# Altium schematic sheet VCO.SchDoc
size A4
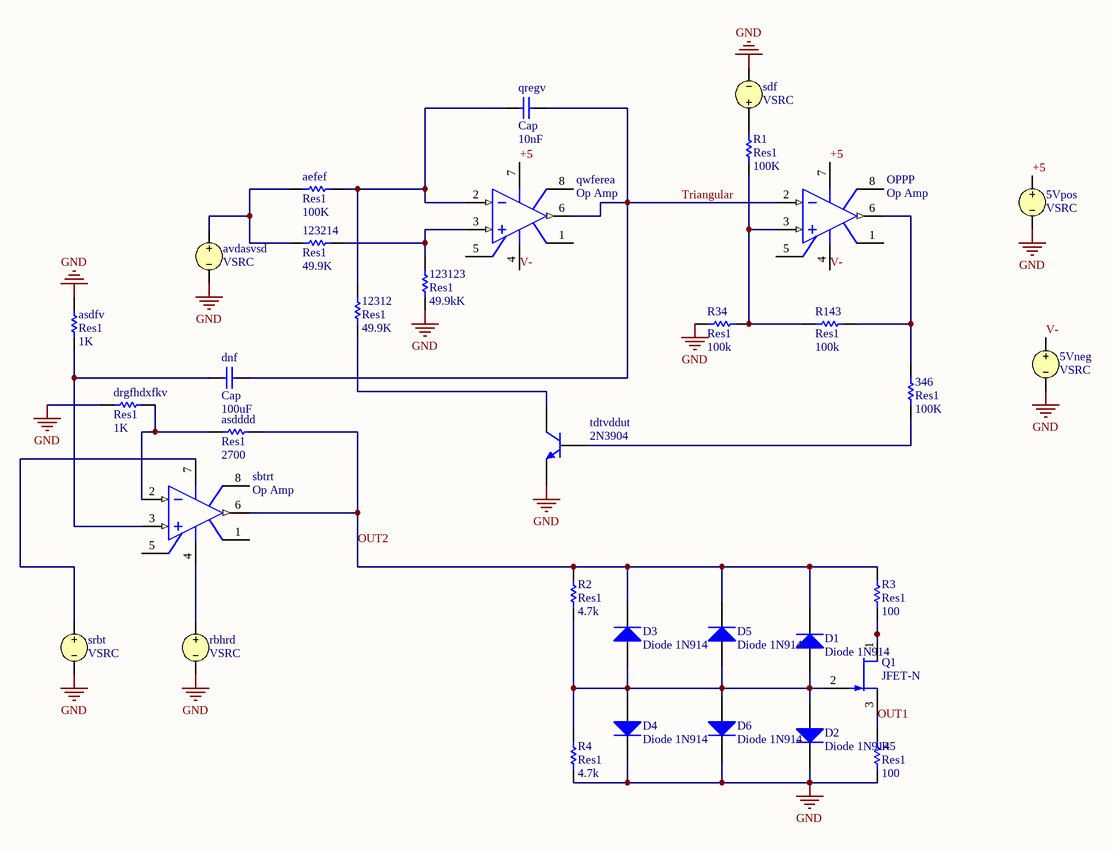
[diagram p0: VCO.SchDoc]

## Parts
5Vneg  VSRC
5Vpos  VSRC
346  Res1  value 100K  [AXIAL-0.3]
12312  Res1  value 49.9K  [AXIAL-0.3]
123123  Res1  value 49.9kK  [AXIAL-0.3]
123214  Res1  value 49.9K  [AXIAL-0.3]
aefef  Res1  value 100K  [AXIAL-0.3]
asdddd  Res1  value 2700  [AXIAL-0.3]
asdfv  Res1  value 1K  [AXIAL-0.3]
avdasvsd  VSRC
D1  Diode 1N914  [DO-35]
D2  Diode 1N914  [DO-35]
D3  Diode 1N914  [DO-35]
D4  Diode 1N914  [DO-35]
D5  Diode 1N914  [DO-35]
D6  Diode 1N914  [DO-35]
dnf  Cap  value 100uF  [RAD-0.3]
drgfhdxfkv  Res1  value 1K  [AXIAL-0.3]
OPPP  Op Amp  [H-08A]
Q1  JFET-N  [TO-254-AA]
qregv  Cap  value 10nF  [RAD-0.3]
qwferea  Op Amp  [H-08A]
R1  Res1  value 100K  [AXIAL-0.3]
R2  Res1  value 4.7k  [AXIAL-0.3]
R3  Res1  value 100  [AXIAL-0.3]
R4  Res1  value 4.7k  [AXIAL-0.3]
R5  Res1  value 100  [AXIAL-0.3]
R34  Res1  value 100k  [AXIAL-0.3]
R143  Res1  value 100k  [AXIAL-0.3]
rbhrd  VSRC
sbtrt  Op Amp  [H-08A]
sdf  VSRC
srbt  VSRC
tdtvddut  2N3904  [TO-92A]

## Nets
GND: 5Vneg.2 5Vpos.2 123123.1 asdfv.2 avdasvsd.2 D2.2(K) D4.2(K) D6.2(K) drgfhdxfkv.2 R4.1 R5.1 R34.1 rbhrd.2 sdf.2 srbt.2 tdtvddut.1(E)
+5: 5Vpos.1 OPPP.7(V+) qwferea.7(V+)
OUT1: Q1.3(S) R5.2
OUT2: asdddd.2 D1.2(K) D3.2(K) D5.2(K) R2.2 R3.2 sbtrt.6(OUT)
Triangular: dnf.2 OPPP.2(IN-) qregv.2 qwferea.6(OUT)
V-: 5Vneg.1 OPPP.4(V-) qwferea.4(V-)
Net346_1: 346.1 tdtvddut.2(B)
Net346_2: 346.2 OPPP.6(OUT) R143.2
Net12312_1: 12312.1 tdtvddut.3(C)
Net12312_2: 12312.2 aefef.2 qregv.1 qwferea.2(IN-)
Net123123_2: 123123.2 123214.2 qwferea.3(IN+)
Net123214_1: 123214.1 aefef.1 avdasvsd.1
Netasdddd_1: asdddd.1 drgfhdxfkv.1 sbtrt.2(IN-)
Netasdfv_1: asdfv.1 dnf.1 sbtrt.3(IN+)
NetD1_1: D1.1(A) D2.1(A) D3.1(A) D4.1(A) D5.1(A) D6.1(A) Q1.2(G) R2.1 R4.2
NetOPPP_3: OPPP.3(IN+) R1.1 R34.2 R143.1
NetQ1_1: Q1.1(D) R3.1
NetR1_2: R1.2 sdf.1
Netrbhrd_1: rbhrd.1 sbtrt.4(V-)
Netsbtrt_7: sbtrt.7(V+) srbt.1

Not connected (* = marked no-connect by the designer): OPPP 1(OS_NUL) 5(OS_NUL) 8(TAB); qwferea 1(OS_NUL) 5(OS_NUL) 8(TAB); sbtrt 1(OS_NUL) 5(OS_NUL) 8(TAB)

## Library data of the parts
5Vneg = VSRC: Voltage Source; Note: PCB Footprint - Not required; Value: -3; Published: 8-Jun-2000; LatestRevisionDate: 17-Jul-2002; LatestRevisionNote: Re-released for DXP Platform.; PackageReference: Not Applicable; Publisher: Altium Limited
5Vpos = VSRC: Voltage Source; Note: PCB Footprint - Not required; Value: 8; Published: 8-Jun-2000; LatestRevisionDate: 17-Jul-2002; LatestRevisionNote: Re-released for DXP Platform.; PackageReference: Not Applicable; Publisher: Altium Limited
346 12312 123123 123214 aefef asdddd asdfv drgfhdxfkv R1-R5 R34 R143 = Res1: Resistor; Published: 8-Jun-2000; LatestRevisionDate: 17-Jul-2002; LatestRevisionNote: Re-released for DXP Platform.; PackageReference: AXIAL-0.3; Publisher: Altium Limited; PackageDescription: Axial Device, Thru-Hole; 2 Leads; 0.3 in Pin Spacing
avdasvsd = VSRC: Voltage Source; Note: PCB Footprint - Not required; Value: +0.1; Published: 8-Jun-2000; LatestRevisionDate: 17-Jul-2002; LatestRevisionNote: Re-released for DXP Platform.; PackageReference: Not Applicable; Publisher: Altium Limited
D1-D6 = Diode 1N914: High Conductance Fast Diode; Published: 8-Jun-2000; LatestRevisionDate: 17-Jul-2002; LatestRevisionNote: Re-released for DXP Platform.; DatasheetVersion: 1997; PackageReference: DO-35; Publisher: Altium Limited; PackageDescription: Diode, Axial; Body 3.8 x 1.9 mm (LxDia. max), Lead Dia. 0.53 mm (max); Code_JEDEC: DO-204-AH; ComponentLink1Description: Manufacturer Link; ComponentLink1URL: http://www.fairchildsemi.com/; ComponentLink2Description: Datasheet; ComponentLink2URL: http://www.fairchildsemi.com/ds/1N%2F1N4448.pdf
dnf qregv = Cap: Capacitor; Published: 8-Jun-2000; LatestRevisionDate: 17-Jul-2002; LatestRevisionNote: Re-released for DXP Platform.; PackageReference: RAD-0.3; Publisher: Altium Limited; PackageDescription: Radial Cap, Thru-Hole; 2 Leads; 0.3 in Pin Spacing
OPPP qwferea sbtrt = Op Amp: FET Operational Amplifier; Published: 8-Jun-2000; LatestRevisionDate: 17-Jul-2002; LatestRevisionNote: Re-released for DXP Platform.; DatasheetVersion: REV. B; PackageVersion: 1990; PackageReference: H-08A; Publisher: Altium Limited; PackageDescription: Can; 8 Leads; Pin Circle Dia. 5.08 mm; Lead Dia. 0.53 mm (max); ComponentLink1Description: Manufacturer Link; ComponentLink1URL: http://www.analog.com/
Q1 = JFET-N: N-Channel JFET; Published: 8-Jun-2000; LatestRevisionDate: 17-Jul-2002; LatestRevisionNote: Re-released for DXP Platform.; PackageReference: TO-254-AA; Publisher: Altium Limited; Code_JEDEC: TO-254-AA
rbhrd = VSRC: Voltage Source; Note: PCB Footprint - Not required; Value: -5; Published: 8-Jun-2000; LatestRevisionDate: 17-Jul-2002; LatestRevisionNote: Re-released for DXP Platform.; PackageReference: Not Applicable; Publisher: Altium Limited
sdf srbt = VSRC: Voltage Source; Note: PCB Footprint - Not required; Value: +5; Published: 8-Jun-2000; LatestRevisionDate: 17-Jul-2002; LatestRevisionNote: Re-released for DXP Platform.; PackageReference: Not Applicable; Publisher: Altium Limited
tdtvddut = 2N3904: NPN General Purpose Amplifier; Published: 8-Jun-2000; LatestRevisionDate: 15-Jan-2003; LatestRevisionNote: PCB Footprint 'BCY-W3/D4.7' replaced; DatasheetVersion: 1997; PackageVersion: Sep-1998; PackageReference: TO-92A; Publisher: Altium Limited; PackageDescription: TO, Flat Index; 3 In-Line, Axial Leads; Body Dia. 4.5mm; Leads 0.51 x 0.48 mm (max); ComponentLink1Description: Manufacturer Link; ComponentLink1URL: http://www.fairchildsemi.com/; ComponentLink2Description: Datasheet; ComponentLink2URL: http://www.fairchildsemi.com/ds/2N%2F2N3904.pdf